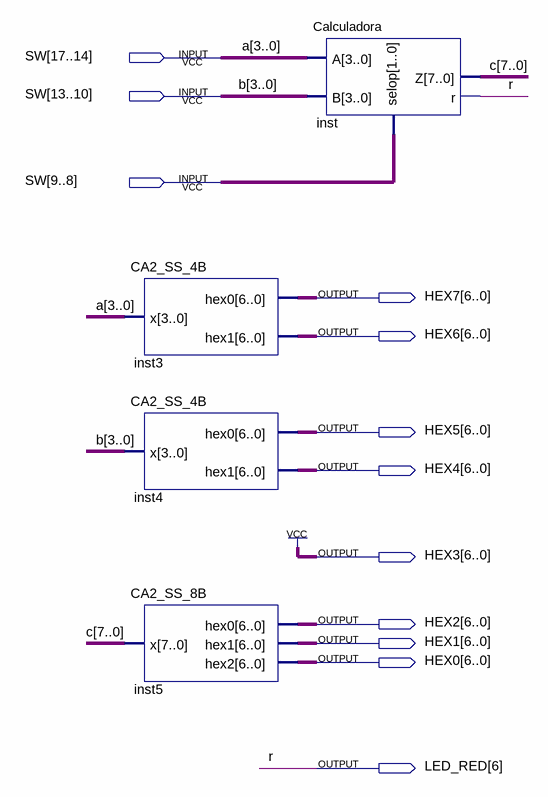
[diagram p0: schematic sheet]
// Quartus schematic MULT_CA2_BCD.bdf as structural Verilog: 4 symbols, 12 pins
module MULT_CA2_BCD (
  input  [17:8] SW,
  output [6:0] HEX7,
  output [6:0] HEX6,
  output [6:0] HEX5,
  output [6:0] HEX4,
  output [6:0] HEX3,
  output [6:0] HEX2,
  output [6:0] HEX1,
  output [6:0] HEX0,
  output [6:6] LED_RED
);

  wire [7:0] c;

  CA2_SS_4B inst3 (.x(SW[17:14]), .hex0(HEX7), .hex1(HEX6));
  CA2_SS_4B inst4 (.x(SW[13:10]), .hex0(HEX5), .hex1(HEX4));
  CA2_SS_8B inst5 (.x(c), .hex0(HEX2), .hex1(HEX1), .hex2(HEX0));
  Calculadora inst (.A(SW[17:14]), .B(SW[13:10]), .selop(SW[9:8]), .Z(c), .r(LED_RED[6]));

  assign HEX3 = {7{1'b1}};

  // Other names for the same wires on the sheet: a[3:0] = SW[17:14]; b[3:0] = SW[13:10]; r = LED_RED[6]
endmodule
